# Altium schematic sheet ADC0844CCN.SchDoc
size A4
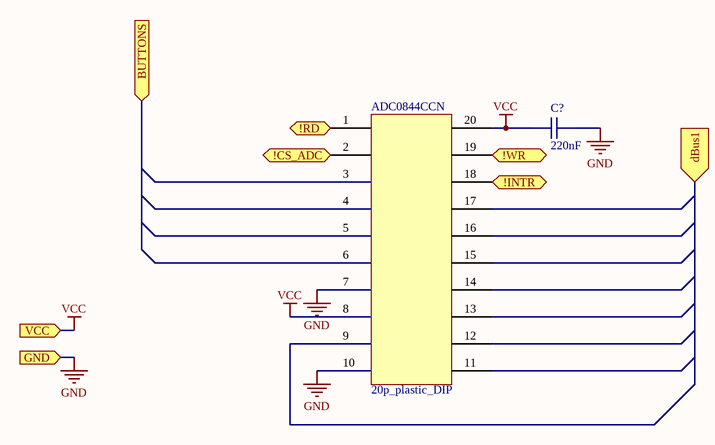
[diagram p0: ADC0844CCN.SchDoc]

## Parts
ADC0844CCN  20p_plastic_DIP
C?  220nF  [CAPC0603(1608)55_N]

## Ports
!CS_ADC (in), !INTR (in), !RD (in), !WR (in), BUTTONS (in), dBus1 (in), GND (in), VCC (in)

## Nets
GND: ADC0844CCN.7 ADC0844CCN.10 C?.1 ; port GND
VCC: ADC0844CCN.8 ADC0844CCN.20 C?.2 ; port VCC
!INTR: ADC0844CCN.18 ; port !INTR
!WR: ADC0844CCN.19 ; port !WR

Not connected (* = marked no-connect by the designer): ADC0844CCN 1 2 3 4 5 6 9 11 12 13 14 15 16 17

## Library data of the parts
C? = 3934: Capacitor; id: 3934; pakke_opprettet_av: 815; pris: 0; nokkelord: kondensator; pakketype: 0603; pakke_opprettet: 18.02.2015 14:18:13; symbol_opprettet_av: 815; symbol_opprettet: 14.11.2014 20:19:34; navn: 220nF